# EasyEDA Pro project 3.3VBuck_1117_joint.epro

# Board 3.3VBuck_1117_joint
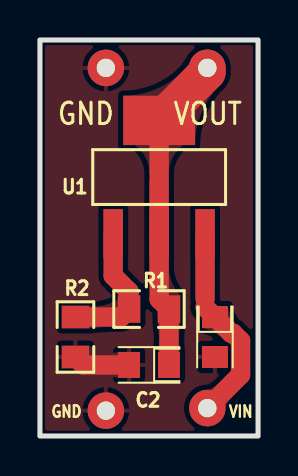
[diagram p0: board, top side]
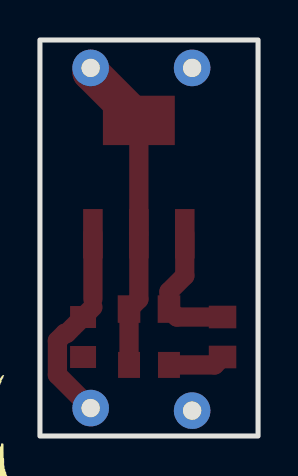
[diagram p1: board, bottom side, seen from below]

Outline 10.92 x 19.81 mm; copper layers: Top Layer, Bottom Layer. Coordinates in mm from the lower left corner of the outline.
Outline path: rectangle 0,19.81 10.92,0
Stack: Top Layer 0.035mm / Dielectric1 1.51mm FR4 er 4.5 / Bottom Layer 0.035mm

## Design rules (mm)
template: JLCPCB Capability(Two Layers Board)
spacing copperThickness1oz (default): track to track 0.102, other pairs 0.152 to 0.3
spacing copperThickness2oz: track to track 0.203, other pairs 0.152 to 0.3
track width copperThickness1oz (default): min 0.127, default 0.254, max 2.54
track width copperThickness2oz: min 0.203, default 0.254, max 2.54
differential pair differentialPair (default): width min 0.127, default 0.254, max 2.54; gap min 0.152, default 0.152
via viaSize (default): diameter min 0.5, default 0.61, max 10; hole min 0.3, default 0.305, max 6.3

## Placement (name value [footprint] x y rotation side)
C1  -  [CAP-SMD_L2.0-W1.3-FD]  8.76 4.95 270 top
C2  10uF  [CAP-SMD_L2.0-W1.3-FD]  5.46 3.56 180 top
NOREF  -  [Pad_e58]  8.38 1.4 0 top
NOREF#2  -  [Pad_e59]  3.3 1.27 0 top
NOREF#3  -  [Pad_e61]  8.38 18.41 0 top
NOREF#4  -  [Pad_e62]  3.3 18.41 0 top
R1  125R  [R0805]  5.46 6.35 0 top
R2  205R  [R0805]  1.78 4.95 90 top
U1  AMS1117-3.3  [SOT-223-4_L6.5-W3.5-P2.30-LS7.0-BR]  5.97 12.95 270 top

## Footprints (pads in the part's own frame, mm; a bottom-side part is the same pattern mirrored in y, then rotated)
CAP-SMD_L2.0-W1.3-FD
  rect 1.1x1.3 smd: 1(-1,0) 2(1,0)
Pad_e58
  round 1.829 hole 0.914: 1(0,0)
Pad_e59
  round 1.829 hole 0.914: 2(0,0)
Pad_e61
  round 1.829 hole 0.914: 1(0,0)
Pad_e62
  round 1.829 hole 0.914: 1(0,0)
R0805
  rect 1.133x1.377 smd: 1(-1,0) 2(1,0)
SOT-223-4_L6.5-W3.5-P2.30-LS7.0-BR
  rect 2.47x0.98 smd: 1(2.835,-2.3) 2(2.835,0) 3(2.835,2.3)
  rect 2.47x3.6 smd: 4(-2.835,0)

## Nets
GND: C1.2 C2.2 NOREF#2.2 NOREF#4.1 R2.1
VIN: C1.1 NOREF.1 U1.3
ADJ: R1.1 R2.2 U1.1
VOUT_3.3V: C2.1 NOREF#3.1 R1.2 U1.2 U1.4

## Routing (per net, layer and track width the routed paths; a pad name or vN(x,y) marks a point on that pad's centre or on a via; arc(x,y) is an arc through that point)
GND: length 2.8
  Top Layer w0.965: R2.1 2.17,3.56 C2.2
VIN: length 9.8
  Top Layer w0.965: 8.27,6.45 C1.1 9.58,5.14 9.68,5.14 10.05,4.77 10.05,3.06 NOREF.1 ; U1.3 8.27,6.86
ADJ: length 6.9
  Top Layer w0.965: R2.2 4.06,5.95 R1.1 4.46,7.22 3.67,8.01 U1.1
VOUT_3.3V: length 16.1
  Top Layer w0.965: U1.4 U1.2 5.97,6.84 R1.2 C2.1
  Top Layer w1.829: NOREF#3.1 8.38,18.2 U1.4

## Copper pours and planes (outline as drawn; the poured copper is in the pictures)
GND on Top Layer: -0.76,20.7 12.95,20.7 12.95,-1.27 -0.76,-1.27

Small or netless copper shapes (teardrops, artwork), in the pictures only: 16 on Top Layer

## Text on the board
Top Silkscreen Layer: VIN | GND | VOUT
